# EasyEDA Pro project ProPrj_Usb_Hub_2026-05-05.epro

# Schematic Schematic1
Board Name: Board1; Create Date: 2026-05-01; Page Name: P1; Project Name: Usb_Hub; Schematic Name: Schematic1; Update Date: 2026-05-01; Company: EasyEDA.com; Page Size: A4; Version: V1.0
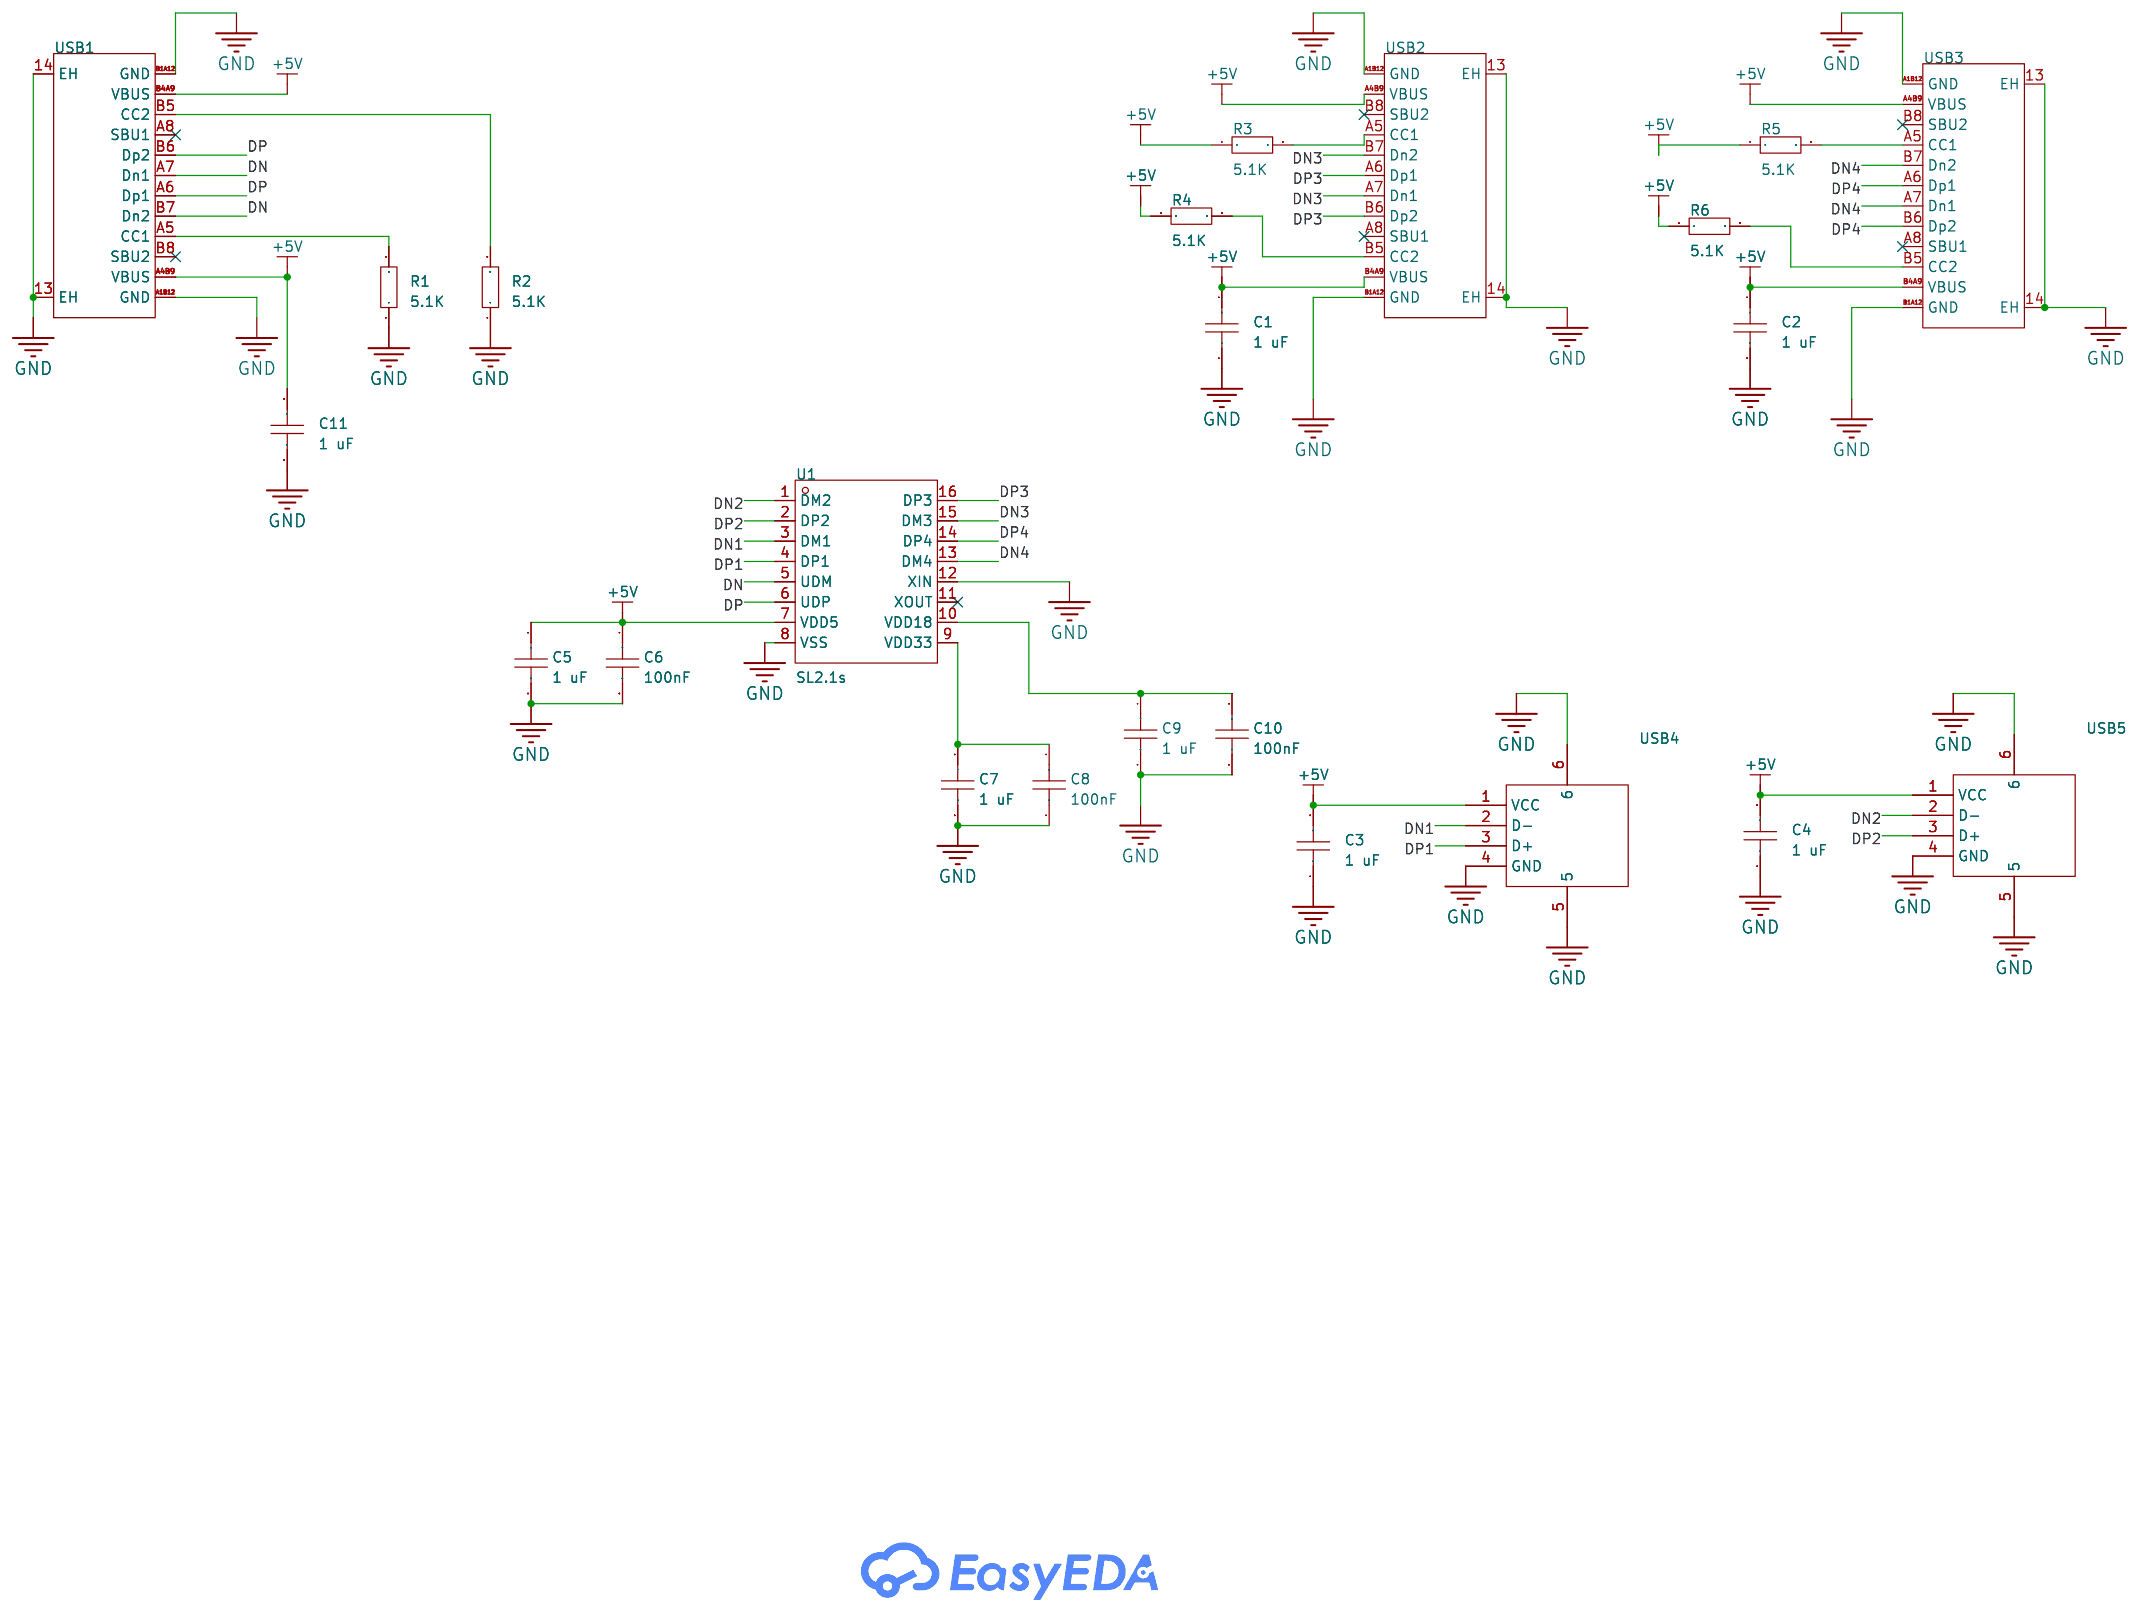
[diagram p0: schematic sheet]

## Parts
C1  1 uF  [C0603]
C2  1 uF  [C0603]
C3  1 uF  [C0603]
C4  1 uF  [C0603]
C5  1 uF  [C0603]
C6  100nF  [C0603]
C7  1 uF  [C0603]
C8  100nF  [C0603]
C9  1 uF  [C0603]
C10  100nF  [C0603]
C11  1 uF  [C0603]
R1  5.1K  [R0603]
R2  5.1K  [R0603]
R3  5.1K  [R0603]
R4  5.1K  [R0603]
R5  5.1K  [R0603]
R6  5.1K  [R0603]
U1  SL2.1s  [SSOP-16_L4.6-W2.6-P0.53-LS4.0-BL]
USB1  TYPE-C 16PIN 2MD(073)  [USB-C-SMD_TYPE-C-16PIN-2MD-073]
USB2  TYPE-C 16PIN 2MD(073)  [USB-C-SMD_TYPE-C-16PIN-2MD-073]
USB3  TYPE-C 16PIN 2MD(073)  [USB-C-SMD_TYPE-C-16PIN-2MD-073]
USB4  10.0 QHHTZB6.3  [USB-A-TH_10.0QHHTZB6.3]
USB5  10.0 QHHTZB6.3  [USB-A-TH_10.0QHHTZB6.3]

## Library data of the parts
C1-C11 = CAP_0603: Supplier Footprint: 0603
R1-R6 = Res_0603: Supplier Footprint: 0603
U1 = SL2.1s: type:Hub USB Protocol:USB 2.0 Data Rate:- Voltage - Supply:4V~5.25V Voltage - Supply:4V~5.25V Operating Temperature:0℃~+70℃ Operating Temperature:0℃~+70℃ Memory Interface:- Current - Supply:120mA Quiescent Supply Current:2.5mA Number of Channels:4; LCSC Part Name: USB2.0 HUB控制器集成电路; Supplier Part: C2684433; Manufacturer: CoreChips(和芯润德); Supplier Footprint: SSOP-16; JLCPCB Part Class: Extended Part; Datasheet: https://item.szlcsc.com/datasheet/SL2.1s/2782346.html; Supplier: LCSC; type: Hub; USB Protocol: USB 2.0; Voltage - Supply: 4V~5.25V; Operating Temperature: 0℃~+70℃; Current - Supply: 120mA; Quiescent Supply Current: 2.5mA; Number of Channels: 4
USB1-USB3 = TYPE-C 16PIN 2MD(073): Connector Type:Type-C Protocol Standard:- Gender:Female Mounting Type:Surface Mount, Right Angle Number of Contacts:16P Number of Ports:1 Current Rating-Power:3A Voltage Rating:5V Connect-Disconnect Life:10,000 Cycles Supplementary Features:- Center Heigh; LCSC Part Name: Type-C 母 卧贴; Supplier Part: C2765186; Manufacturer: SHOU HAN(首韩); Supplier Footprint: SMD; JLCPCB Part Class: Extended Part; Datasheet: https://item.szlcsc.com/datasheet/TYPE-C%252016PIN%25202MD(073)/2901843.html; Supplier: LCSC; Connector Type: Type-C; Gender: Female; Mounting Type: Surface Mount, Right Angle; Number of Contacts: 16P; Number of Ports: 1; Current Rating-Power: 3A; Voltage Rating: 5V; Connect-Disconnect Life: 10,000 Cycles; Detection color: Black; Operating Temperature: -25℃~+85℃
USB4 USB5 = 10.0 QHHTZB6.3: Connector Type:Type-A Protocol Standard:USB 2.0 Gender:Female Mounting Type:Surface Mount, Right Angle Number of Contacts:4P Number of Ports:1 Current Rating-Power:1.5A Voltage Rating:30V Connect-Disconnect Life:5,000 times Supplementary Features:- Center; LCSC Part Name: 壳长10.0mm; Supplier Part: C668591; Manufacturer: SHOU HAN(首韩); Supplier Footprint: SMD; JLCPCB Part Class: Extended Part; Datasheet: https://item.szlcsc.com/datasheet/10.0%2520QHHTZB6.3/698534.html; Supplier: LCSC; Connector Type: Type-A; Protocol Standard: USB 2.0; Gender: Female; Mounting Type: Surface Mount, Right Angle; Number of Contacts: 4P; Number of Ports: 1; Current Rating-Power: 1.5A; Voltage Rating: 30V; Connect-Disconnect Life: 5,000 times; Length: 10mm; Detection color: Black; Operating Temperature: -25℃~+85℃

## Nets
+5V: C1.1 C2.1 C3.2 C4.2 C5.1 C6.1 C11.1 R3.1 R4.1 R5.1 R6.1 U1.7(VDD5) USB1.A4B9(VBUS) USB1.B4A9(VBUS) USB2.A4B9(VBUS) USB2.B4A9(VBUS) USB3.A4B9(VBUS) USB3.B4A9(VBUS) USB4.1(VCC) USB5.1(VCC)
GND: C1.2 C2.2 C3.1 C4.1 C5.2 C6.2 C7.2 C8.2 C9.2 C10.2 C11.2 R1.1 R2.1 U1.8(VSS) U1.12(XIN) USB1.13(EH) USB1.14(EH) USB1.A1B12(GND) USB1.B1A12(GND) USB2.13(EH) USB2.14(EH) USB2.A1B12(GND) USB2.B1A12(GND) USB3.13(EH) USB3.14(EH) USB3.A1B12(GND) USB3.B1A12(GND) USB4.4(GND) USB4.5 USB4.6 USB5.4(GND) USB5.5 USB5.6
DN: U1.5(UDM) USB1.A7(Dn1) USB1.B7(Dn2)
DN1: U1.3(DM1) USB4.2(D-)
DN2: U1.1(DM2) USB5.2(D-)
DN3: U1.15(DM3) USB2.A7(Dn1) USB2.B7(Dn2)
DN4: U1.13(DM4) USB3.A7(Dn1) USB3.B7(Dn2)
DP: U1.6(UDP) USB1.A6(Dp1) USB1.B6(Dp2)
DP1: U1.4(DP1) USB4.3(D+)
DP2: U1.2(DP2) USB5.3(D+)
DP3: U1.16(DP3) USB2.A6(Dp1) USB2.B6(Dp2)
DP4: U1.14(DP4) USB3.A6(Dp1) USB3.B6(Dp2)
$1N1094: R1.2 USB1.A5(CC1)
$1N1099: R2.2 USB1.B5(CC2)
$1N2154: R3.2 USB2.A5(CC1)
$1N2189: R4.2 USB2.B5(CC2)
$1N2216: R5.2 USB3.A5(CC1)
$1N2251: R6.2 USB3.B5(CC2)
$1N2782: C9.1 C10.1 U1.10(VDD18)
$1N2788: C7.1 C8.1 U1.9(VDD33)

Not connected (* = marked no-connect by the designer): U1 11(XOUT)*; USB1 A8(SBU1)* B8(SBU2)*; USB2 A8(SBU1)* B8(SBU2)*; USB3 A8(SBU1)* B8(SBU2)*

# Board PCB1
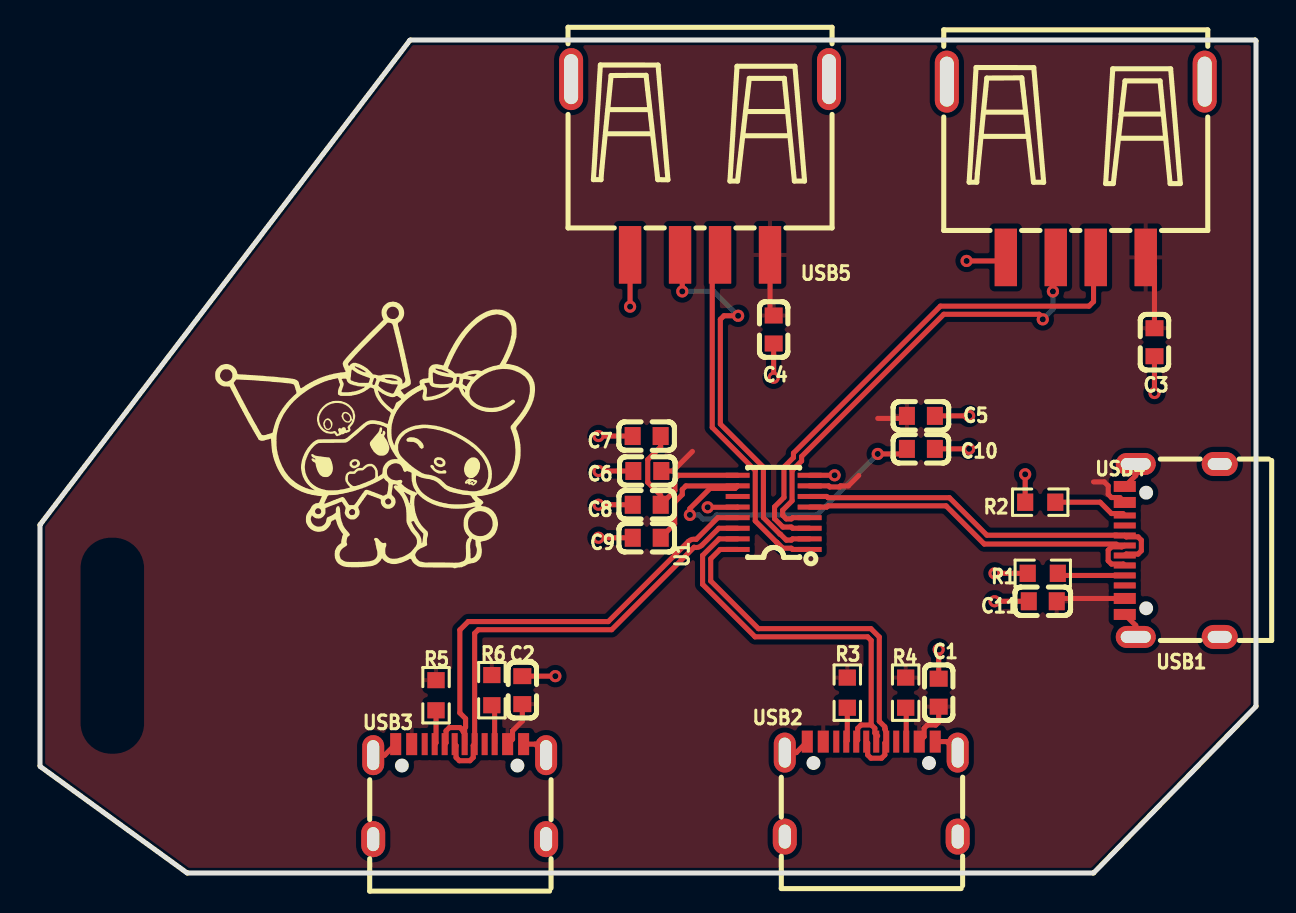
[diagram p1: board, top side]
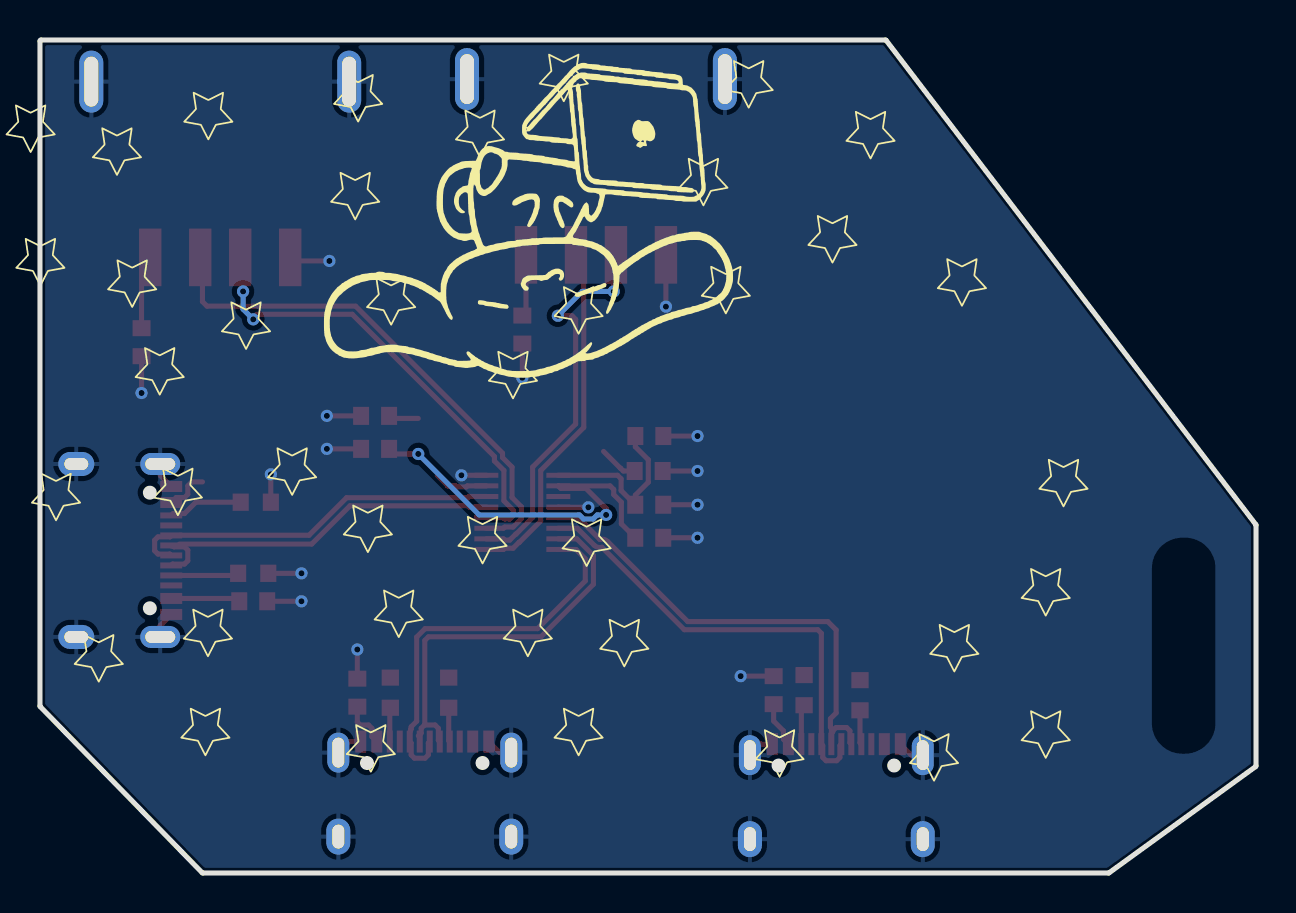
[diagram p2: board, bottom side, seen from below]

Outline 60.83 x 41.66 mm; copper layers: Top Layer, Bottom Layer. Coordinates in mm from the lower left corner of the outline.
Outline path: 0,17.4 arc(0,17.41) 0.01,17.43 18.5,41.64 arc(18.52,41.65) 18.54,41.66 60.78,41.66 arc(60.82,41.64) 60.83,41.61 60.83,8.35 arc(60.83,8.34) 60.82,8.32 52.72,0.02 arc(52.7,0) 52.68,0 7.38,0 arc(7.36,0) 7.35,0.01 0.02,5.32 arc(0.01,5.34) 0,5.36 0,17.4
Stack: Top Layer 0.035mm / Dielectric1 1.51mm FR4 er 4.5 / Bottom Layer 0.035mm

## Design rules (mm)
net DN2: DP5
net DP2: DP5
net DN1: DP2
net DP1: DP2
net DN: DP1
net DP: DP1
net DN4: DP3
net DP4: DP3
net DN3: DP4
net DP3: DP4
template: Custom Config
spacing copperThickness1oz (default): track to track 0.102, other pairs 0.152 to 0.3
spacing copperThickness2oz: track to track 0.203, other pairs 0.152 to 0.3
track width copperThickness1oz (default): min 0.127, default 0.254, max 2.54
track width copperThickness2oz: min 0.203, default 0.254, max 2.54
differential pair differentialPair (default): width min 0.127, default 0.254, max 2.54; gap min 0.152, default 0.152
via viaSize (default): diameter min 0.5, default 0.61, max 10; hole min 0.3, default 0.305, max 6.3

## Placement (name value [footprint] x y rotation side)
C1  1 uF  [C0603]  44.96 9.02 90 top
C2  1 uF  [C0603]  24.13 9.14 90 top
C3  1 uF  [C0603]  55.75 26.54 90 top
C4  1 uF  [C0603]  36.7 27.18 90 top
C5  1 uF  [C0603]  44.07 22.86 0 top
C6  100nF  [C0603]  30.38 20.1 180 top
C7  1 uF  [C0603]  30.35 21.85 180 top
C8  100nF  [C0603]  30.35 18.42 180 top
C9  1 uF  [C0603]  30.35 16.76 180 top
C10  100nF  [C0603]  44.07 21.21 0 top
C11  1 uF  [C0603]  50.16 13.59 180 top
R1  5.1K  [R0603]  50.16 14.99 0 top
R2  5.1K  [R0603]  50.04 18.54 0 top
R3  5.1K  [R0603]  40.39 9.02 270 top
R4  5.1K  [R0603]  43.31 9.02 270 top
R5  5.1K  [R0603]  19.81 8.89 270 top
R6  5.1K  [R0603]  22.61 9.14 270 top
U1  SL2.1s  [SSOP-16_L4.6-W2.6-P0.53-LS4.0-BL]  36.7 18.03 90 top
USB1  TYPE-C 16PIN 2MD(073)  [USB-C-SMD_TYPE-C-16PIN-2MD-073]  56.64 16.13 90 top
USB2  TYPE-C 16PIN 2MD(073)  [USB-C-SMD_TYPE-C-16PIN-2MD-073]  41.58 4.2 0 top
USB3  TYPE-C 16PIN 2MD(073)  [USB-C-SMD_TYPE-C-16PIN-2MD-073]  20.99 4.07 0 top
USB4  10.0 QHHTZB6.3  [USB-A-TH_10.0QHHTZB6.3]  51.82 35.18 180 top
USB5  10.0 QHHTZB6.3  [USB-A-TH_10.0QHHTZB6.3]  33.02 35.31 180 top

## Footprints (pads in the part's own frame, mm; a bottom-side part is the same pattern mirrored in y, then rotated)
C0603
  rect 0.8x0.9 smd: 1(-0.7,0) 2(0.7,0)
R0603
  rect 0.806x0.864 smd: 1(-0.753,0) 2(0.753,0)
SSOP-16_L4.6-W2.6-P0.53-LS4.0-BL
  rect 0.25x1.2 smd: 1(-1.855,-1.8) 2(-1.325,-1.8) 3(-0.795,-1.8) 4(-0.265,-1.8) 5(0.265,-1.8) 6(0.795,-1.8) 7(1.325,-1.8) 8(1.855,-1.8) 9(1.855,1.8) 10(1.325,1.8) 11(0.795,1.8) 12(0.265,1.8) 13(-0.265,1.8) 14(-0.795,1.8) 15(-1.325,1.8) 16(-1.855,1.8)
USB-A-TH_10.0QHHTZB6.3
  rect 1.12x2.88 smd: 1(-3.5,4.395) 2(-1,4.395) 3(1,4.395) 4(3.5,4.395)
  oval 1.2x3.1 hole 0.7x2.5: 5(-6.45,-4.395) 6(6.45,-4.395)
USB-C-SMD_TYPE-C-16PIN-2MD-073
  oval 1.1x2 hole 0.6x1.5: 13(-4.325,1.825) 14(4.325,1.825)
  oval 1.2x1.8 hole 0.6x1.2: 13(-4.325,-2.375) 14(4.325,-2.375)
  rect 0.55x1.1 smd: A1B12(-3.2,2.375) A4B9(-2.4,2.375) B1A12(3.2,2.375) B4A9(2.4,2.375)
  rect 0.3x1.1 smd: A5(-1.25,2.375) A6(-0.25,2.375) A7(0.25,2.375) A8(1.25,2.375) B5(1.75,2.375) B6(0.75,2.375) B7(-0.75,2.375) B8(-1.75,2.375)

## Nets
As in the schematic.

Pads without a net: U1 11; USB1 A8 B8; USB2 A8 B8; USB3 A8 B8

## Via types
v1: diameter 0.61, hole 0.305, Top Layer to Bottom Layer, 23 vias

## Routing (per net, layer and track width the routed paths; a pad name or vN(x,y) marks a point on that pad's centre or on a via; arc(x,y) is an arc through that point)
+5V: length 23.4
  Top Layer w0.254: USB2.B4A9 44.23,6.82 44.23,7.24 44.39,7.4 44.81,7.4 44.96,7.54 C1.1 ; C4.2 36.52,28.06 USB5.1 ; 32.64,21.08 31.8,20.25 31.79,20.25 31.65,20.1 C6.1 ; USB1.A4B9 51,13.73 50.87,13.59 ; C2.1 24.13,7.6 23.64,7.11 23.64,6.69 USB3.B4A9 ; C5.1 43.24,22.73 41.91,22.73 ; 52.71,19.56 53.24,19.56 53.44,19.36 53.44,18.94 53.6,18.78 54.02,18.78 54.27,18.53 ; C3.2 55.75,30.35 USB4.1 ; 40.96,19.88 40.44,19.36 40.05,19.36 39.99,19.31 39.51,19.31 39.46,19.36 U1.7
GND: length 37.4
  Top Layer w0.254: USB3.B1A12 24.77,6.44 USB3.14 ; C10.2 v1(46.48,21.21) ; USB3.A1B12 17.24,5.89 USB3.13 ; C6.2 v1(27.94,20.1) ; 54.27,19.33 54.82,19.88 USB1.14 ; R1.1 v1(47.75,14.99) ; USB1.13 54.82,12.38 USB1.A1B12 ; C3.1 v1(55.75,24) ; USB2.B1A12 45.36,6.57 USB2.14 ; v1(33.4,18.29) 34.89,18.29 U1.12 ; 44.64,22.86 v1(46.48,22.86) ; C2.2 v1(25.78,9.84) ; USB2.A1B12 37.83,6.02 USB2.13 ; C7.2 v1(27.94,21.85) ; v1(46.36,30.61) 48.14,30.61 USB4.4 ; C11.2 v1(47.75,13.59) ; 38.5,19.89 v1(39.75,19.89) ; C4.1 v1(36.7,24.77) ; C1.2 v1(44.96,11.18) ; C8.2 v1(27.94,18.42) ; USB5.4 v1(29.52,28.32) ; R2.1 v1(49.28,19.94) ; C9.2 v1(27.94,16.76)
DN: length 18.5
  Top Layer w0.254: USB1.A7 54.24,16.36 54.17,16.36 54.12,16.31 53.6,16.31 53.44,16.14 53.44,15.61 53.6,15.45 54.2,15.45 USB1.B7 ; U1.5 39.36,18.3 39.42,18.36 45.33,18.36 47.24,16.45 53.85,16.45
DN1: length 26
  Top Layer w0.254: U1.3 37.65,17.24 37.59,17.3 37.16,17.3 36.75,17.72 36.75,18.31 37.22,18.78 37.22,20.3 37.69,20.77 37.69,21 45.04,28.35 52.48,28.35 52.71,28.58 52.71,30.67 USB4.2
DN2: length 17.7
  Top Layer w0.254: U1.1 37.65,16.18 37.59,16.24 37.16,16.24 36.87,16.54 36.85,16.54 35.78,17.61 35.78,20.13 33.63,22.28 33.63,30.52 USB5.2
DN3: length 19.5
  Top Layer w0.254: U1.15 33.97,16.71 33.15,15.88 33.15,14.44 35.77,11.81 41.4,11.81 41.58,11.63 41.58,7.42 41.6,7.4 ; 41.6,7.4 41.07,7.4 40.91,7.24 40.91,6.64 USB2.B7 ; 41.6,7.4 41.76,7.24 41.76,7 41.91,6.86
DN4: length 23.9
  Top Layer w0.254: U1.13 33.91,17.77 32.83,16.68 arc(32.62,16.68) 32.43,16.58 28.43,12.57 21.42,12.57 21,12.16 21,8 21.29,7.72 21.29,7.29 21.24,7.25 21.24,6.99 ; USB3.B7 20.32,6.51 20.32,7.11 20.48,7.27 21.01,7.27 21.17,7.11 21.17,7.06 21.24,6.99 ; 21.24,6.99 USB3.A7
DP: length 18.5
  Top Layer w0.254: USB1.B6 54.34,16.81 54.93,16.81 55.1,16.64 55.1,16.11 54.93,15.95 54.34,15.95 USB1.A6 ; 38.5,18.83 39.36,18.83 39.42,18.77 45.5,18.77 47.37,16.89 53.85,16.89
DP1: length 23.3
  Top Layer w0.254: v1(50.16,27.69) 50.16,27.76 49.99,27.94 45.21,27.94 38.1,20.83 38.1,20.61 37.62,20.13 37.62,18.61 37.15,18.14 37.15,17.89 37.33,17.71 37.59,17.71 37.65,17.77 U1.4 ; v1(50.67,29.08) 50.67,30.64 USB4.3
  Bottom Layer w0.254: v1(50.67,29.08) 50.67,28.19 v1(50.16,27.69)
DP2: length 19.7
  Top Layer w0.254: U1.2 37.65,16.71 37.59,16.65 37.33,16.65 37.04,16.94 37.02,16.94 36.19,17.77 36.19,20.3 34.04,22.45 34.04,27.69 34.22,27.87 v1(34.93,27.87) ; USB5.3 32.13,30.8 v1(32.13,29.08)
  Bottom Layer w0.254: v1(34.93,27.87) 33.71,29.08 v1(32.13,29.08)
DP3: length 19.4
  Top Layer w0.254: USB2.A6 41.41,6.5 41.41,5.91 41.57,5.74 42.1,5.74 42.26,5.91 42.26,6.5 USB2.B6 ; 42.29,7.11 42.29,7.11 42.29,7.18 42.26,7.21 42.26,7.31 41.99,7.59 41.99,11.8 41.57,12.22 35.94,12.22 33.55,14.61 33.55,15.71 34.02,16.18 U1.16
DP4: length 23.2
  Top Layer w0.254: U1.14 33.96,17.24 33.11,16.39 arc(32.93,16.29) 32.72,16.29 28.6,12.17 21.92,12.17 21.74,11.99 USB3.B6 21.67,6.37 21.67,5.78 21.51,5.61 20.98,5.61 20.82,5.78 20.82,6.37 USB3.A6
$1N1094: length 3.4
  Top Layer w0.254: USB1.A5 51.03,14.88 R1.2
$1N1099: length 3.8
  Top Layer w0.254: USB1.B5 54.17,17.97 53.6,17.97 53.03,18.54 R2.2
$1N2154: length 1.7
  Top Layer w0.254: R3.2 40.39,6.62 USB2.A5
$1N2189: length 1.7
  Top Layer w0.254: R4.2 43.33,8.24 USB2.B5
$1N2216: length 1.7
  Top Layer w0.254: USB3.A5 19.81,6.51 R5.2
$1N2251: length 2
  Top Layer w0.254: USB3.B5 22.74,8.25 R6.2
$1N2782: length 21.3
  Top Layer w0.254: v1(32.51,17.91) 32.51,18.22 33.52,19.23 34.78,19.23 34.9,19.36 ; C10.1 43.12,20.95 v1(41.91,20.95) ; 34.9,19.36 32.31,19.36 32.13,19.18 32.13,18.92 31.75,18.54 31.75,17.46 C9.1 ; 34.9,19.36 U1.10
  Bottom Layer w0.254: v1(41.91,20.95) 38.86,17.91 33.85,17.91 33.64,17.7 33.16,17.7 32.96,17.91 v1(32.51,17.91)
$1N2788: length 8.8
  Top Layer w0.254: C7.1 31.05,21.31 30.4,20.67 30.4,19.54 31.05,18.89 31.05,18.42 C8.1 31.76,19.12 31.76,19.71 31.94,19.89 34.9,19.89

## Copper pours and planes (outline as drawn; the poured copper is in the pictures)
+5V on Top Layer: -7.75,49.28 68.07,49.28 68.07,-7.24 -7.75,-7.24
GND on Bottom Layer: -1.65,46.99 62.87,46.99 62.87,-8 -1.65,-8
